# Altium project power_supply.PrjPCB
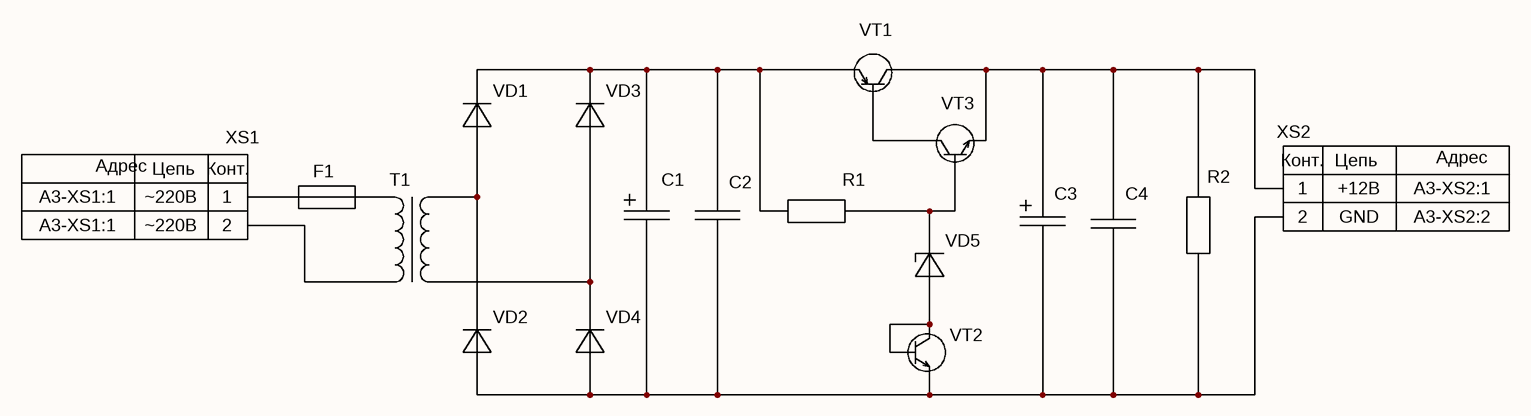
[diagram p0: power_supply.SchDoc]
1 sheet, 18 parts. Net scope: global (net labels, ports and power ports of the same name join across sheets).
Board files: power_supply_pcb.PcbDoc, mask.PcbDoc

## Sheet power_supply.SchDoc
size 420 x 297 mm; PageSetup: Record=PageOptions|CenterHorizontal=True|CenterVertical=True|PrintScale=0.94|XCorrection=1.00|YCorrection=1.00|PrintKind=1|BorderSize=5000000|LeftOffset=0|BottomOffset=0|Orientation=1|PaperLength=1000|PaperWidth=1000|Scale=100|PaperSource=7|PrintQuality=-4|MediaType=1|DitherType=10|PaperKind=A4|PrintScaleMode=1; DecimalNumber: Децимальный номер; HeadOfSector: Нач. сектора; MainDevice: Перв.примен.; Name: Наименование

### Parts
C1  1000 мкФ  [CAP: D10C5H20]  (value not drawn)
C2  100 нФ  [CAP: 1206]  (value not drawn)
C3  220 мкФ  [CAP: D6.3C2.5H11]  (value not drawn)
C4  100нФ  [CAP: 1206]  (value not drawn)
F1  0.5 А  [FUSE: 0679H (BelFuse)]  (value not drawn)
R1  330 Ом  [RES: 1206]  (value not drawn)
R2  1 кОм  [RES: 1206]  (value not drawn)
T1  Trans_1_1  [15v_0.7A_trans]  (value not drawn)
VD1  1n5400  [1n5400-1n5408]  (value not drawn)
VD2  1n5400  [1n5400-1n5408]  (value not drawn)
VD3  1n5400  [1n5400-1n5408]  (value not drawn)
VD4  1n5400  [1n5400-1n5408]  (value not drawn)
VD5  1n4742  [1n4728-1n4764]  (value not drawn)
VT1  2SB1132T100Q  [SOT89]  (value not drawn)
VT2  2n4401  [TO-92]  (value not drawn)
VT3  2n4401  [TO-92]  (value not drawn)
XS1  circuit2: ~220В  =address2: A3-XS1:1  [CON: DG350-3.5-02P]  (hidden comment: X2)
XS2  circuit2: GND  circuit1: +12В  =address2: A3-XS2:2  =address1: A3-XS2:1  [CON: CWF-2]  (hidden comment: X2)

### Nets
NetC1_1: C1.1 C2.2 R1.1 VD1.2 VD3.2 VT1.3(e)
NetC1_2: C1.2 C2.1 C3.2 C4.2 R2.1 VD2.1 VD4.1 VT2.3(e) XS2.2
NetC3_1: C3.1 C4.1 R2.2 VT1.2(c) VT3.3(e) XS2.1
NetF1_1: F1.1 XS1.1
NetF1_2: F1.2 T1.1
NetR1_2: R1.2 VD5.2 VT3.1(b)
NetT1_2: T1.2 XS1.2
NetT1_3: T1.3 VD1.1 VD2.2
NetT1_4: T1.4 VD3.1 VD4.2
NetVD5_1: VD5.1 VT2.1(b) VT2.2(c)
NetVT1_1: VT1.1(b) VT3.2(c)

### Notes on the sheet
- Перв.примен.
- Справ.№
- Подп. и дата
- Инв.№ дубл.
- Взам.инв.№
- Подп.и дата
- Разраб.
- Изм.
- Лист
- № докум.
- Подп.
- Дата
- Лит.
- Масштаб
- Масса
- Т.контр.
- Пров.
- Листов
- Инв.№ подл.
- Утв.
- Н.контр.
- Нач.сект.
- Формат  A3
- (in symbol X2) Конт.; Цепь; Адрес

### Library data of the parts
C1 C3 = C_pol
C2 C4 = C_const
F1 = fuse
R1 R2 = Res
T1 = Trans_1_1: pin to pad: 4>5
VD1-VD4 = VD
VD5 = zener
VT1 = pnp
VT2 VT3 = npn: pin to pad: 1>2 2>3 3>1
XS1 XS2 = X2
  XS1: circuit1: ~220В; =address1: A3-XS1:1